# Altium project PowerSupply.PRJPCB
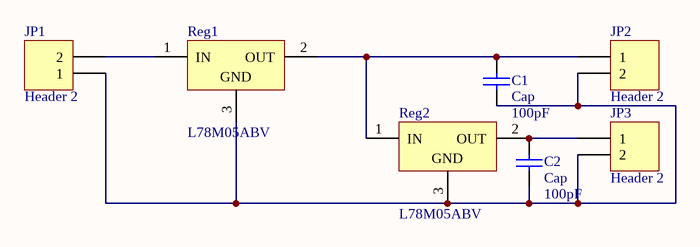
[diagram p0: PowerSupply.SCHDOC]
1 sheet, 7 parts. Net scope: global (net labels, ports and power ports of the same name join across sheets).
Board file: PowerSupply.PCBDOC

## Sheet PowerSupply.SCHDOC
size A

### Parts
C1  Cap  value 100pF  [RAD-0.3]
C2  Cap  value 100pF  [RAD-0.3]
JP1  Header 2  [HDR1X2]
JP2  Header 2  [HDR1X2]
JP3  Header 2  [HDR1X2]
Reg1  L78M05ABV  [TO220V]
Reg2  L78M05ABV  [TO220V]

### Nets
NetC1_1: C1.1 C2.1 JP1.1 JP2.2 JP3.2 Reg1.3(GND) Reg2.3(GND)
NetC1_2: C1.2 JP2.1 Reg1.2(OUT) Reg2.1(IN)
NetC2_2: C2.2 JP3.1 Reg2.2(OUT)
NetJP1_2: JP1.2 Reg1.1(IN)

### Library data of the parts
C1 C2 = Cap: Capacitor; Published: 8-Jun-2000; Revision: July-2002: Re-released for DXP Platform.; Publisher: Altium Limited
JP1-JP3 = Header 2: Header, 2-Pin; Revision: 17-Jul-2002: Re-released for DXP Platform.; Publisher: Altium Limited
Reg1 Reg2 = L78M05ABV: Precision 500mA Regulator; Note: Tab is connected to pin 3 (GND).; Published: 24-Aug-2001; Revision: 17-Jul-2002: Re-released for DXP Platform.; Datasheet: Latest Revision: Mar-1997; Package Reference: TO220V; Publisher: Altium Limited